# EAGLE design PIC16F15376-breakout (EAGLE 9.4.1)
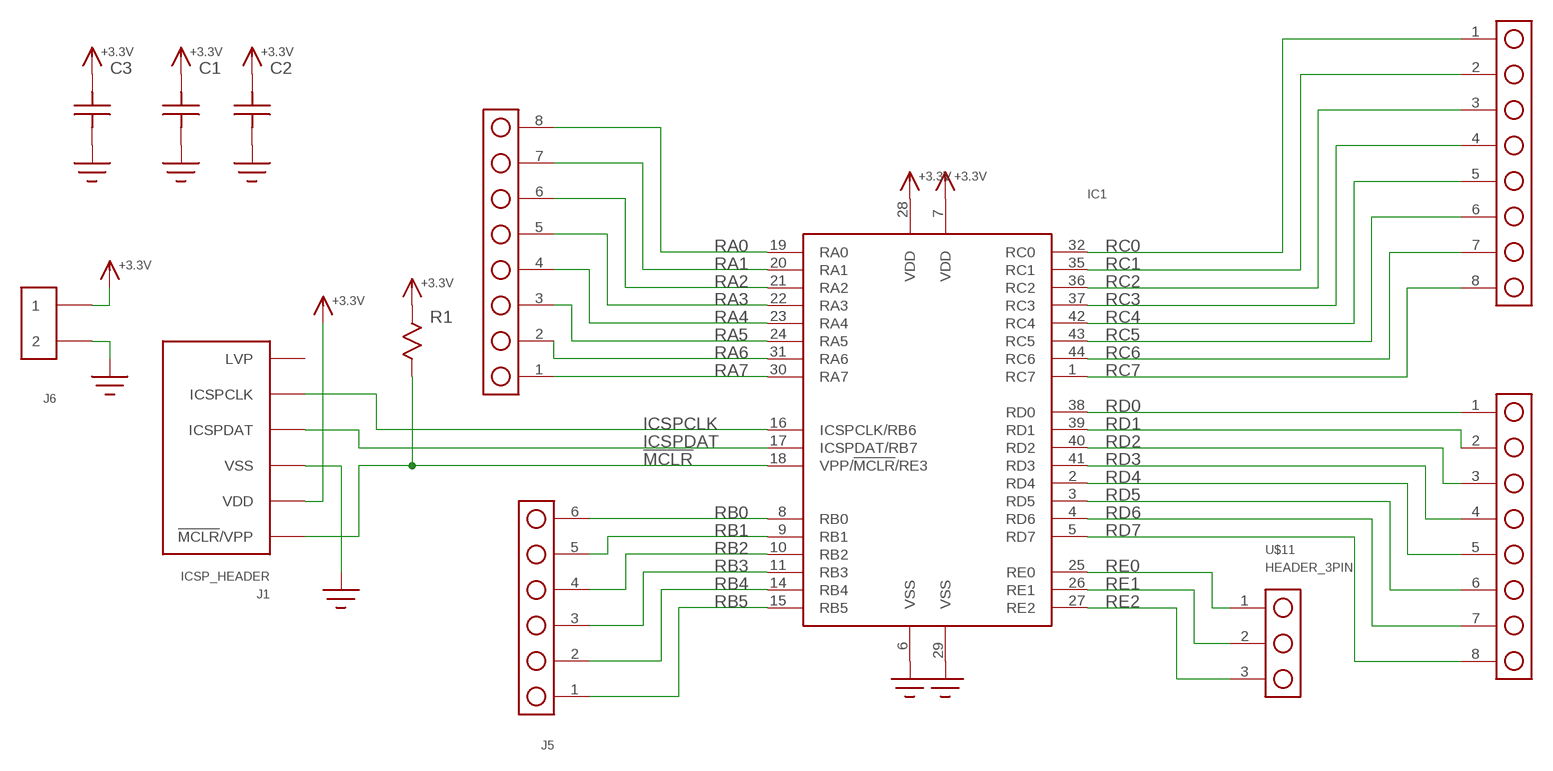
[diagram p0: schematic, sheet 1]

## Parts
C1  C0603  [C0603]
C2  C0603  [C0603]
C3  C1206  [1206]
IC1  PIC16F15376  [TQFP44]
J1  ICSP_HEADER  [HEADER_6PIN]
J2  HEADER_8PIN  [HEADER_8_PIN]
J3  HEADER_8PIN  [HEADER_8_PIN]
J4  HEADER_8PIN  [HEADER_8_PIN]
J5  HEADER_6PIN  [HEADER_6PIN]
J6  HEADER_2PIN  [HEADER_2PIN]
R1  R0603  [R0603]
U$11  HEADER_3PIN  [HEADER_3PIN]

## Nets
!MCLR!: IC1.18(VPP/!MCLR!/RE3) J1.1(!MCLR!/VPP) R1.P$2
+3.3V: C1.P$2 C2.P$2 C3.P$2 IC1.7(VDD) IC1.28(VDD) J1.2(VDD) J6.1 R1.P$1
GND: C1.P$1 C2.P$1 C3.P$1 IC1.6(VSS) IC1.29(VSS) J1.3(VSS) J6.2
ICSPCLK: IC1.16(ICSPCLK/RB6) J1.5(ICSPCLK)
ICSPDAT: IC1.17(ICSPDAT/RB7) J1.4(ICSPDAT)
RA0: IC1.19(RA0) J2.8
RA1: IC1.20(RA1) J2.7
RA2: IC1.21(RA2) J2.6
RA3: IC1.22(RA3) J2.5
RA4: IC1.23(RA4) J2.4
RA5: IC1.24(RA5) J2.3
RA6: IC1.31(RA6) J2.2
RA7: IC1.30(RA7) J2.1
RB0: IC1.8(RB0) J5.6
RB1: IC1.9(RB1) J5.5
RB2: IC1.10(RB2) J5.4
RB3: IC1.11(RB3) J5.3
RB4: IC1.14(RB4) J5.2
RB5: IC1.15(RB5) J5.1
RC0: IC1.32(RC0) J3.1
RC1: IC1.35(RC1) J3.2
RC2: IC1.36(RC2) J3.3
RC3: IC1.37(RC3) J3.4
RC4: IC1.42(RC4) J3.5
RC5: IC1.43(RC5) J3.6
RC6: IC1.44(RC6) J3.7
RC7: IC1.1(RC7) J3.8
RD0: IC1.38(RD0) J4.1
RD1: IC1.39(RD1) J4.2
RD2: IC1.40(RD2) J4.3
RD3: IC1.41(RD3) J4.4
RD4: IC1.2(RD4) J4.5
RD5: IC1.3(RD5) J4.6
RD6: IC1.4(RD6) J4.7
RD7: IC1.5(RD7) J4.8
RE0: IC1.25(RE0) U$11.1
RE1: IC1.26(RE1) U$11.2
RE2: IC1.27(RE2) U$11.3
Unconnected: J1.6(LVP)

## Library data of the parts
C1-C3 = yapo:C
IC1 = yapo:PIC16F15376
J1 = yapo:ICSP_HEADER
J2-J4 = yapo:HEADER_8PIN
J5 = yapo:HEADER_6PIN
J6 = yapo:HEADER_2PIN
R1 = yapo:R
U$11 = yapo:HEADER_3PIN

## Board
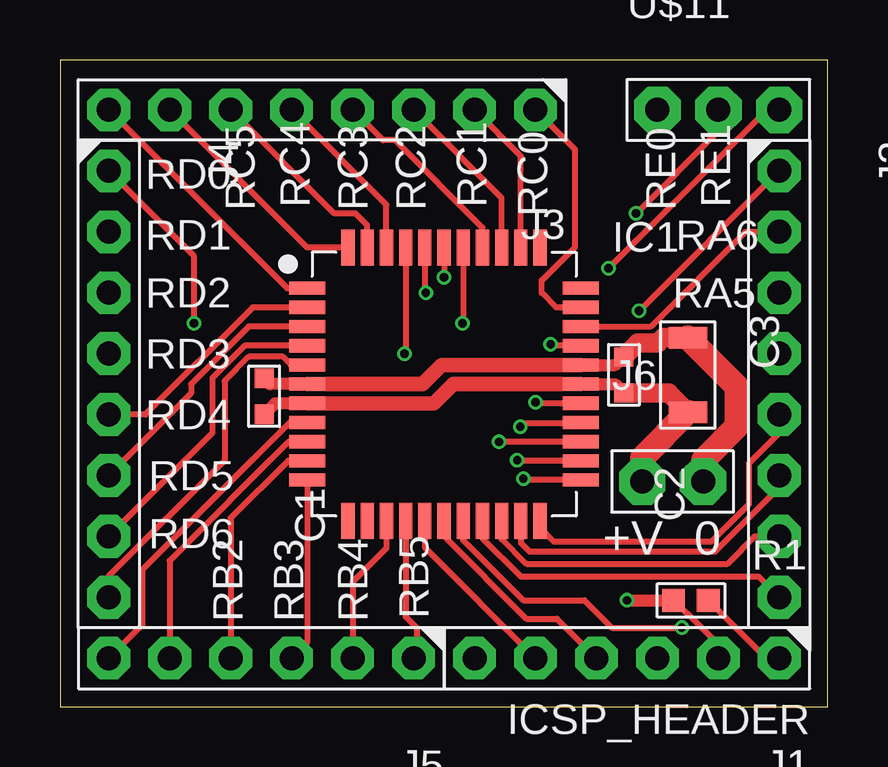
[diagram p1: board, top side]
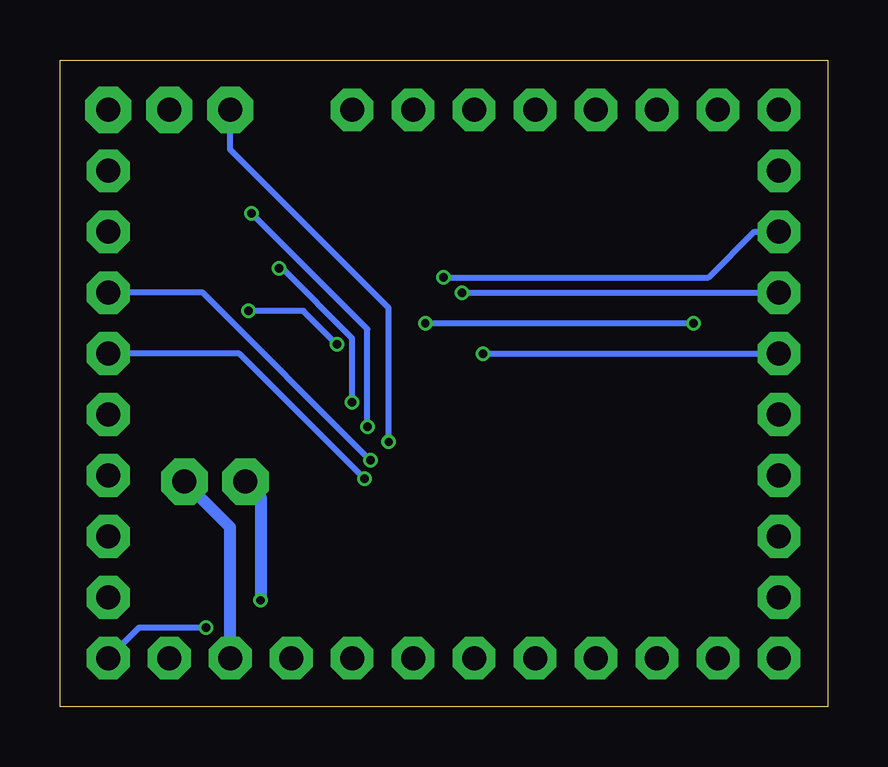
[diagram p2: board, bottom side, seen from below]

Size 31.98 x 26.98 mm. Coordinates in mm from the lower left corner, seen from the top.
Outline: 0,0 31.98,0 31.98,26.98 0,26.98 0,0
Copper layers (1*16): Top 0.035559375mm / dielectric 1.6mm / Bottom 0.035559375mm
Design rules "oshpark-2layer *": minimum track width 6mil, minimum drill 10mil, track to track 6mil, track to pad 6mil, pad to pad 6mil, via to via 6mil, smd to smd 6mil, copper to edge 15mil, drill to drill 6mil, minimum pad ring 5mil, minimum via ring 5mil, stop-mask expansion 2.5mil, vias tented up to drill 20mil, thermal gap 10mil

### Footprints (pad centres in the part's own frame; a part is rotated, then mirrored left to right if it is on the bottom)
C0603 = smd 0.8 x 0.8: P$1 -0.75,0; P$2 0.75,0
1206 = smd 0.9 x 1.6: P$1 -1.55,0; P$2 1.55,0
TQFP44 = smd 1.5 x 0.55: 1 -5.7,4; 2 -5.7,3.2; 3 -5.7,2.4; 4 -5.7,1.6; 5 -5.7,0.8; 6 -5.7,0; 7 -5.7,-0.8; 8 -5.7,-1.6; 9 -5.7,-2.4; 10 -5.7,-3.2; 11 -5.7,-4; 23 5.7,-4; 24 5.7,-3.2; 25 5.7,-2.4; 26 5.7,-1.6; 27 5.7,-0.8; 28 5.7,0; 29 5.7,0.8; 30 5.7,1.6; 31 5.7,2.4; 32 5.7,3.2; 33 5.7,4 | smd 0.55 x 1.5: 12 -4,-5.7; 13 -3.2,-5.7; 14 -2.4,-5.7; 15 -1.6,-5.7; 16 -0.8,-5.7; 17 0,-5.7; 18 0.8,-5.7; 19 1.6,-5.7; 20 2.4,-5.7; 21 3.2,-5.7; 22 4,-5.7; 34 4,5.7; 35 3.2,5.7; 36 2.4,5.7; 37 1.6,5.7; 38 0.8,5.7; 39 0,5.7; 40 -0.8,5.7; 41 -1.6,5.7; 42 -2.4,5.7; 43 -3.2,5.7; 44 -4,5.7
HEADER_6PIN = drill 1 pad 1.778 octagon: 1 -6.35,0; 2 -3.81,0; 3 -1.27,0; 4 1.27,0; 5 3.81,0; 6 6.35,0
HEADER_8_PIN = drill 1 pad 1.778 octagon: 1 -8.89,0; 2 -6.35,0; 3 -3.81,0; 4 -1.27,0; 5 1.27,0; 6 3.81,0; 7 6.35,0; 8 8.89,0
HEADER_2PIN = drill 1 pad 1.93 octagon: 1 -1.27,0; 2 1.27,0
R0603 = smd 0.95 x 0.95: P$1 -0.725,0; P$2 0.725,0
HEADER_3PIN = drill 1 pad 1.93 octagon: 1 -2.54,0; 2 0,0; 3 2.54,0

### Placement (x,y rotation side)
C1  8.51,12.95 270 top
C2  23.5,13.84 270 top
C3  26.16,13.84 270 top
IC1  16,13.46 0 top
J1  23.62,2.03 180 top
J2  29.97,13.46 270 top
J3  10.92,24.89 180 top
J4  2.03,13.46 270 top
J5  8.38,2.03 180 top
J6  25.53,9.4 0 top
R1  26.29,4.45 0 top
U$11  27.43,24.89 0 top

### Tracks (layer width: path | path; a pad name or v marks a point on that pad's centre or on a via)
!MCLR!  (via drill 0.35)
  Top 0.254: R1.P$2 29.43,2.03 J1.1 | IC1.18 16.8,6.95 19.3,4.45 21.84,4.45 22.99,3.3 v25.91,3.3
  Bottom 0.254: v25.91,3.3 28.7,3.3 J1.1
+3.3V  (via drill 0.35)
  Top 0.254: R1.P$1 26.13,3.88 26.15,3.88 27.43,2.6 J1.2
  Top 0.508: IC1.7 8.97,12.66 C1.P$2 | IC1.28 23.13,13.46 C2.P$2 | v23.62,4.45 R1.P$1
  Top 0.61: IC1.7 15.58,12.66 16.38,13.46 IC1.28
  Top 0.813: C2.P$2 25.36,13.09 C3.P$2
  Top 1.016: J6.1 24.26,10.39 C3.P$2
  Bottom 0.508: J6.1 23.62,8.76 v23.62,4.45
GND
  Top 0.508: IC1.6 8.75,13.46 C1.P$1 | IC1.29 23.16,14.26 C2.P$1
  Top 0.61: IC1.6 15.11,13.46 15.91,14.26 IC1.29
  Top 0.813: C2.P$1 24.08,15.18 24.91,15.18 25.13,15.39 C3.P$1
  Top 1.016: J6.2 26.8,10.29 28.19,11.68 28.19,13.36 C3.P$1
  Bottom 0.508: J1.3 24.89,7.49 J6.2
ICSPCLK
  Top 0.254: IC1.16 15.2,6.64 J1.5
ICSPDAT
  Top 0.254: IC1.17 16,7.11 19.43,3.68 20.7,3.68 J1.4
RA0
  Top 0.254: IC1.19 17.6,7.04 19.2,5.44 29.11,5.44 J2.8
RA1
  Top 0.254: IC1.20 18.4,7 19.43,5.97 27.81,5.97 28.96,7.11 J2.7
RA2
  Top 0.254: IC1.21 19.2,6.83 19.56,6.48 27.3,6.48 29.97,9.14 J2.6
RA3
  Top 0.254: J2.5 29.97,11.43 28.7,10.16 28.7,8.45 27.14,6.88 20.57,6.88 20,7.46 IC1.22
RA4  (via drill 0.35)
  Top 0.254: IC1.23 19.37,9.46 v19.3,9.53
  Bottom 0.254: v19.3,9.53 24.51,14.73 J2.4
RA5  (via drill 0.35)
  Top 0.254: IC1.24 19.07,10.26 v19.05,10.29
  Bottom 0.254: v19.05,10.29 26.04,17.27 J2.3
RA6
  Top 0.254: IC1.31 24.62,15.86 28.57,19.81 J2.2
RA7  (via drill 0.35)
  Top 0.254: IC1.30 20.45,15.06 v20.45,15.11 | v24.13,16.51 J2.1
  Bottom 0.254: v20.45,15.11 21.84,16.51 v24.13,16.51
RB0
  Top 0.254: IC1.8 9.58,11.86 3.43,5.71 3.43,3.43 J5.6
RB1
  Top 0.254: IC1.9 9.54,11.06 4.57,6.1 J5.5
RB2
  Top 0.254: IC1.10 9.5,10.26 7.11,7.87 J5.4
RB3
  Top 0.254: IC1.11 10.3,2.68 J5.3
RB4
  Top 0.254: IC1.14 13.6,6.62 12.19,5.21 J5.2
RB5
  Top 0.254: IC1.15 14.4,3.76 14.86,3.3 14.86,2.16 J5.1
RC0
  Top 0.254: IC1.32 20.68,16.66 20.07,17.27 20.07,17.78 21.46,19.18 21.46,23.24 J3.1
RC1
  Top 0.254: IC1.35 19.2,22.96 J3.2
RC2
  Top 0.254: IC1.36 18.4,21.22 J3.3
RC3
  Top 0.254: IC1.37 17.6,19.99 13.97,23.62 13.46,23.62 J3.4
RC4
  Top 0.254: IC1.42 13.6,20.94 J3.5
RC5
  Top 0.254: IC1.43 12.8,20.09 12.32,20.57 11.43,20.57 J3.6
RC6
  Top 0.254: IC1.44 10.3,19.16 J3.7
RC7
  Top 0.254: J3.8 9.46,17.46 IC1.1
RD0  (via drill 0.35)
  Top 0.254: IC1.38 16.8,16.04 v16.76,16 | v5.59,16 5.59,18.8 J4.1
  Bottom 0.254: v16.76,16 v5.59,16
RD1  (via drill 0.35)
  Top 0.254: IC1.39 v16,17.91
  Bottom 0.254: v16,17.91 4.95,17.91 3.05,19.81 J4.2
RD2  (via drill 0.35)
  Top 0.254: IC1.40 15.2,17.31 v15.24,17.27
  Bottom 0.254: v15.24,17.27 J4.3
RD3  (via drill 0.35)
  Top 0.254: IC1.41 14.4,14.78 v14.35,14.73
  Bottom 0.254: v14.35,14.73 J4.4
RD4
  Top 0.254: IC1.2 8.03,16.66 3.56,12.19 J4.5
RD5
  Top 0.254: IC1.3 7.86,15.86 5.46,13.46 5.46,13.08 J4.6
RD6
  Top 0.254: IC1.4 7.7,15.06 6.35,13.72 6.35,11.43 J4.7
RD7
  Top 0.254: IC1.5 9.61,14.26 9.27,14.61 7.87,14.61 6.86,13.59 6.86,10.29 2.03,5.46 J4.8
RE0  (via drill 0.35)
  Top 0.254: IC1.25 21.69,11.05 v18.29,11.05
  Bottom 0.254: v18.29,11.05 18.29,16.64 24.89,23.24 U$11.1
RE1  (via drill 0.35)
  Top 0.254: IC1.26 21.65,11.81 19.3,11.81 v19.18,11.68 | v24,20.57 27.43,24 U$11.2
  Bottom 0.254: v19.18,11.68 19.18,15.75 v24,20.57
RE2  (via drill 0.35)
  Top 0.254: IC1.27 19.85,12.66 v19.81,12.7 | v22.86,18.29 29.46,24.89 U$11.3
  Bottom 0.254: v19.81,12.7 19.81,15.37 22.73,18.29 v22.86,18.29

### Text on the board
tPlace: RD0 | RC5 | RC4 | RC3 | RC2 | RC1 | RE0 | RE1 | RC0 | RD1 | RA6 | RD2 | RA5 | RD3 | RD4 | RD5 | RD6 | +V | 0 | RB2 | RB3 | RB4 | RB5